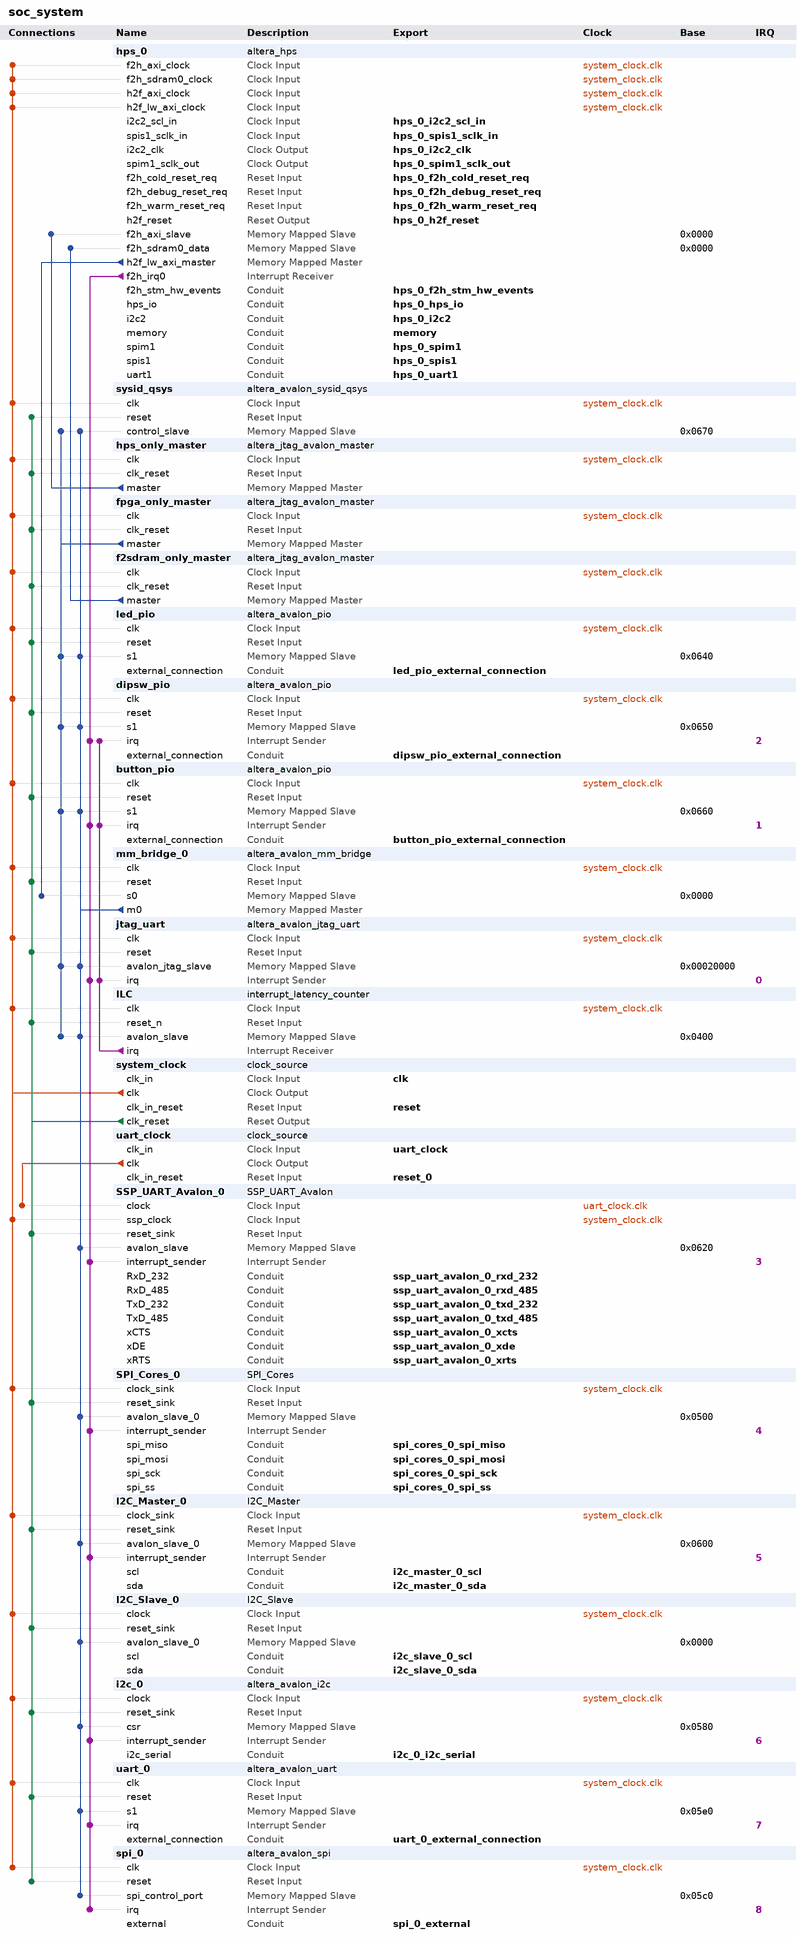
[diagram p0: system contents]
# Platform Designer (Qsys) system soc_system, Cyclone V 5CSXFC6D6F31C6
# Parameters at their usual value, and those the tool derives, are not listed.
package require -exact qsys 18.1
create_system soc_system
set_project_property DEVICE_FAMILY {Cyclone V}
set_project_property DEVICE 5CSXFC6D6F31C6

add_instance hps_0 altera_hps 18.1
set_instance_parameter_value hps_0 EMAC1_Mode RGMII
set_instance_parameter_value hps_0 EMAC1_PinMuxing {HPS I/O Set 0}
set_instance_parameter_value hps_0 F2SCLK_COLDRST_Enable true
set_instance_parameter_value hps_0 F2SCLK_DBGRST_Enable true
set_instance_parameter_value hps_0 F2SCLK_WARMRST_Enable true
set_instance_parameter_value hps_0 F2SDRAM_Type {Avalon-MM Bidirectional}
set_instance_parameter_value hps_0 F2SDRAM_Width 256
set_instance_parameter_value hps_0 F2SINTERRUPT_Enable true
set_instance_parameter_value hps_0 F2S_Width 2
set_instance_parameter_value hps_0 FPGA_PERIPHERAL_OUTPUT_CLOCK_FREQ_EMAC0_GTX_CLK 100
set_instance_parameter_value hps_0 FPGA_PERIPHERAL_OUTPUT_CLOCK_FREQ_EMAC0_MD_CLK 100.0
set_instance_parameter_value hps_0 FPGA_PERIPHERAL_OUTPUT_CLOCK_FREQ_EMAC1_GTX_CLK 100
set_instance_parameter_value hps_0 FPGA_PERIPHERAL_OUTPUT_CLOCK_FREQ_EMAC1_MD_CLK 100.0
set_instance_parameter_value hps_0 HPS_PROTOCOL DDR3
set_instance_parameter_value hps_0 I2C0_Mode I2C
set_instance_parameter_value hps_0 I2C0_PinMuxing {HPS I/O Set 0}
set_instance_parameter_value hps_0 I2C1_Mode I2C
set_instance_parameter_value hps_0 I2C1_PinMuxing {HPS I/O Set 0}
set_instance_parameter_value hps_0 I2C2_Mode Full
set_instance_parameter_value hps_0 I2C2_PinMuxing FPGA
set_instance_parameter_value hps_0 LWH2F_Enable true
set_instance_parameter_value hps_0 MEM_BANKADDR_WIDTH 3
set_instance_parameter_value hps_0 MEM_CLK_FREQ 400.0
set_instance_parameter_value hps_0 MEM_COL_ADDR_WIDTH 10
set_instance_parameter_value hps_0 MEM_DQ_WIDTH 32
set_instance_parameter_value hps_0 MEM_DRV_STR RZQ/6
set_instance_parameter_value hps_0 MEM_ROW_ADDR_WIDTH 15
set_instance_parameter_value hps_0 MEM_RTT_NOM RZQ/6
set_instance_parameter_value hps_0 MEM_RTT_WR {Dynamic ODT off}
set_instance_parameter_value hps_0 MEM_TCL 11
set_instance_parameter_value hps_0 MEM_TFAW_NS 45.0
set_instance_parameter_value hps_0 MEM_TRAS_NS 35.0
set_instance_parameter_value hps_0 MEM_TRCD_NS 13.75
set_instance_parameter_value hps_0 MEM_TRFC_NS 260.0
set_instance_parameter_value hps_0 MEM_TRP_NS 13.75
set_instance_parameter_value hps_0 MEM_VENDOR Micron
set_instance_parameter_value hps_0 MEM_WTCL 7
set_instance_parameter_value hps_0 QSPI_Mode {1 SS}
set_instance_parameter_value hps_0 QSPI_PinMuxing {HPS I/O Set 0}
set_instance_parameter_value hps_0 REF_CLK_FREQ 25.0
set_instance_parameter_value hps_0 S2FCLK_USER2CLK 5
set_instance_parameter_value hps_0 S2F_Width 2
set_instance_parameter_value hps_0 SDIO_Mode {4-bit Data}
set_instance_parameter_value hps_0 SDIO_PinMuxing {HPS I/O Set 0}
set_instance_parameter_value hps_0 SPIM0_Mode {Single Slave Select}
set_instance_parameter_value hps_0 SPIM0_PinMuxing {HPS I/O Set 0}
set_instance_parameter_value hps_0 SPIM1_Mode Full
set_instance_parameter_value hps_0 SPIM1_PinMuxing FPGA
set_instance_parameter_value hps_0 SPIS1_Mode Full
set_instance_parameter_value hps_0 SPIS1_PinMuxing FPGA
set_instance_parameter_value hps_0 STM_Enable true
set_instance_parameter_value hps_0 TIMING_BOARD_AC_SKEW 0.02
set_instance_parameter_value hps_0 TIMING_BOARD_AC_TO_CK_SKEW 0.01
set_instance_parameter_value hps_0 TIMING_BOARD_DQ_TO_DQS_SKEW 0.05
set_instance_parameter_value hps_0 TIMING_BOARD_MAX_CK_DELAY 0.03
set_instance_parameter_value hps_0 TIMING_BOARD_MAX_DQS_DELAY 0.02
set_instance_parameter_value hps_0 TIMING_BOARD_SKEW_BETWEEN_DQS 0.06
set_instance_parameter_value hps_0 TIMING_BOARD_SKEW_CKDQS_DIMM_MAX 0.12
set_instance_parameter_value hps_0 TIMING_BOARD_SKEW_CKDQS_DIMM_MIN 0.06
set_instance_parameter_value hps_0 TIMING_BOARD_SKEW_WITHIN_DQS 0.01
set_instance_parameter_value hps_0 TIMING_TDH 65
set_instance_parameter_value hps_0 TIMING_TDQSCK 255
set_instance_parameter_value hps_0 TIMING_TDQSQ 125
set_instance_parameter_value hps_0 TIMING_TDS 30
set_instance_parameter_value hps_0 TIMING_TIH 140
set_instance_parameter_value hps_0 TIMING_TIS 190
set_instance_parameter_value hps_0 TIMING_TQSH 0.4
set_instance_parameter_value hps_0 UART0_Mode {No Flow Control}
set_instance_parameter_value hps_0 UART0_PinMuxing {HPS I/O Set 0}
set_instance_parameter_value hps_0 UART1_Mode Full
set_instance_parameter_value hps_0 UART1_PinMuxing FPGA
set_instance_parameter_value hps_0 USB1_Mode SDR
set_instance_parameter_value hps_0 USB1_PinMuxing {HPS I/O Set 0}
set_instance_parameter_value hps_0 desired_cfg_clk_mhz 100.0
set_instance_parameter_value hps_0 desired_qspi_clk_mhz 400.0

add_instance sysid_qsys altera_avalon_sysid_qsys 18.1
set_instance_parameter_value sysid_qsys id -1395322110

add_instance hps_only_master altera_jtag_avalon_master 18.1

add_instance fpga_only_master altera_jtag_avalon_master 18.1

add_instance f2sdram_only_master altera_jtag_avalon_master 18.1

add_instance led_pio altera_avalon_pio 18.1
set_instance_parameter_value led_pio direction Output
set_instance_parameter_value led_pio width 10

add_instance dipsw_pio altera_avalon_pio 18.1
set_instance_parameter_value dipsw_pio bitClearingEdgeCapReg true
set_instance_parameter_value dipsw_pio captureEdge true
set_instance_parameter_value dipsw_pio direction Input
set_instance_parameter_value dipsw_pio edgeType ANY
set_instance_parameter_value dipsw_pio generateIRQ true
set_instance_parameter_value dipsw_pio irqType EDGE
set_instance_parameter_value dipsw_pio width 10

add_instance button_pio altera_avalon_pio 18.1
set_instance_parameter_value button_pio bitClearingEdgeCapReg true
set_instance_parameter_value button_pio captureEdge true
set_instance_parameter_value button_pio direction Input
set_instance_parameter_value button_pio edgeType FALLING
set_instance_parameter_value button_pio generateIRQ true
set_instance_parameter_value button_pio irqType EDGE
set_instance_parameter_value button_pio width 4

add_instance mm_bridge_0 altera_avalon_mm_bridge 18.1
set_instance_parameter_value mm_bridge_0 ADDRESS_UNITS SYMBOLS
set_instance_parameter_value mm_bridge_0 ADDRESS_WIDTH 10
set_instance_parameter_value mm_bridge_0 DATA_WIDTH 32
set_instance_parameter_value mm_bridge_0 MAX_PENDING_RESPONSES 4
set_instance_parameter_value mm_bridge_0 USE_AUTO_ADDRESS_WIDTH 1

add_instance jtag_uart altera_avalon_jtag_uart 18.1
set_instance_parameter_value jtag_uart allowMultipleConnections true
set_instance_parameter_value jtag_uart simInteractiveOptions INTERACTIVE_ASCII_OUTPUT

add_instance ILC interrupt_latency_counter 18.1
set_instance_parameter_value ILC CLOCK_RATE 150000000

add_instance system_clock clock_source 18.1
set_instance_parameter_value system_clock clockFrequency 150000000

add_instance uart_clock clock_source 18.1
set_instance_parameter_value uart_clock clockFrequency 48000000

add_instance SSP_UART_Avalon_0 SSP_UART_Avalon 1.0

add_instance SPI_Cores_0 SPI_Cores 1.0
set_instance_parameter_value SPI_Cores_0 Tp 1

add_instance I2C_Master_0 I2C_Master 1.0

add_instance I2C_Slave_0 I2C_Slave 1.0

add_instance i2c_0 altera_avalon_i2c 18.1
set_instance_parameter_value i2c_0 FIFO_DEPTH 256

add_instance uart_0 altera_avalon_uart 18.1
set_instance_parameter_value uart_0 baud 115200
set_instance_parameter_value uart_0 dataBits 8
set_instance_parameter_value uart_0 fixedBaud false
set_instance_parameter_value uart_0 parity NONE
set_instance_parameter_value uart_0 stopBits 1

add_instance spi_0 altera_avalon_spi 18.1
set_instance_parameter_value spi_0 clockPolarity 0
set_instance_parameter_value spi_0 dataWidth 8
set_instance_parameter_value spi_0 masterSPI false
set_instance_parameter_value spi_0 numberOfSlaves 1
set_instance_parameter_value spi_0 targetClockRate 128000

# connections
add_connection system_clock.clk button_pio.clk clock
add_connection system_clock.clk dipsw_pio.clk clock
add_connection system_clock.clk f2sdram_only_master.clk clock
add_connection system_clock.clk fpga_only_master.clk clock
add_connection system_clock.clk hps_0.f2h_axi_clock clock
add_connection system_clock.clk hps_0.f2h_sdram0_clock clock
add_connection system_clock.clk hps_0.h2f_axi_clock clock
add_connection system_clock.clk hps_0.h2f_lw_axi_clock clock
add_connection system_clock.clk hps_only_master.clk clock
add_connection system_clock.clk i2c_0.clock clock
add_connection system_clock.clk I2C_Master_0.clock_sink clock
add_connection system_clock.clk I2C_Slave_0.clock clock
add_connection system_clock.clk ILC.clk clock
add_connection system_clock.clk jtag_uart.clk clock
add_connection system_clock.clk led_pio.clk clock
add_connection system_clock.clk mm_bridge_0.clk clock
add_connection system_clock.clk spi_0.clk clock
add_connection system_clock.clk SPI_Cores_0.clock_sink clock
add_connection system_clock.clk SSP_UART_Avalon_0.ssp_clock clock
add_connection system_clock.clk sysid_qsys.clk clock
add_connection system_clock.clk uart_0.clk clock
add_connection uart_clock.clk SSP_UART_Avalon_0.clock clock
add_connection system_clock.clk_reset button_pio.reset reset
add_connection system_clock.clk_reset dipsw_pio.reset reset
add_connection system_clock.clk_reset f2sdram_only_master.clk_reset reset
add_connection system_clock.clk_reset fpga_only_master.clk_reset reset
add_connection system_clock.clk_reset hps_only_master.clk_reset reset
add_connection system_clock.clk_reset i2c_0.reset_sink reset
add_connection system_clock.clk_reset I2C_Master_0.reset_sink reset
add_connection system_clock.clk_reset I2C_Slave_0.reset_sink reset
add_connection system_clock.clk_reset ILC.reset_n reset
add_connection system_clock.clk_reset jtag_uart.reset reset
add_connection system_clock.clk_reset led_pio.reset reset
add_connection system_clock.clk_reset mm_bridge_0.reset reset
add_connection system_clock.clk_reset spi_0.reset reset
add_connection system_clock.clk_reset SPI_Cores_0.reset_sink reset
add_connection system_clock.clk_reset SSP_UART_Avalon_0.reset_sink reset
add_connection system_clock.clk_reset sysid_qsys.reset reset
add_connection system_clock.clk_reset uart_0.reset reset
add_connection f2sdram_only_master.master hps_0.f2h_sdram0_data avalon
set_connection_parameter_value f2sdram_only_master.master/hps_0.f2h_sdram0_data baseAddress 0x0000
add_connection fpga_only_master.master button_pio.s1 avalon
set_connection_parameter_value fpga_only_master.master/button_pio.s1 baseAddress 0x0660
add_connection fpga_only_master.master dipsw_pio.s1 avalon
set_connection_parameter_value fpga_only_master.master/dipsw_pio.s1 baseAddress 0x0650
add_connection fpga_only_master.master ILC.avalon_slave avalon
set_connection_parameter_value fpga_only_master.master/ILC.avalon_slave baseAddress 0x0400
add_connection fpga_only_master.master jtag_uart.avalon_jtag_slave avalon
set_connection_parameter_value fpga_only_master.master/jtag_uart.avalon_jtag_slave baseAddress 0x00020000
add_connection fpga_only_master.master led_pio.s1 avalon
set_connection_parameter_value fpga_only_master.master/led_pio.s1 baseAddress 0x0640
add_connection fpga_only_master.master sysid_qsys.control_slave avalon
set_connection_parameter_value fpga_only_master.master/sysid_qsys.control_slave baseAddress 0x0670
add_connection hps_0.h2f_lw_axi_master mm_bridge_0.s0 avalon
set_connection_parameter_value hps_0.h2f_lw_axi_master/mm_bridge_0.s0 baseAddress 0x0000
add_connection hps_only_master.master hps_0.f2h_axi_slave avalon
set_connection_parameter_value hps_only_master.master/hps_0.f2h_axi_slave baseAddress 0x0000
add_connection mm_bridge_0.m0 button_pio.s1 avalon
set_connection_parameter_value mm_bridge_0.m0/button_pio.s1 baseAddress 0x0660
add_connection mm_bridge_0.m0 dipsw_pio.s1 avalon
set_connection_parameter_value mm_bridge_0.m0/dipsw_pio.s1 baseAddress 0x0650
add_connection mm_bridge_0.m0 i2c_0.csr avalon
set_connection_parameter_value mm_bridge_0.m0/i2c_0.csr baseAddress 0x0580
add_connection mm_bridge_0.m0 I2C_Master_0.avalon_slave_0 avalon
set_connection_parameter_value mm_bridge_0.m0/I2C_Master_0.avalon_slave_0 baseAddress 0x0600
add_connection mm_bridge_0.m0 I2C_Slave_0.avalon_slave_0 avalon
set_connection_parameter_value mm_bridge_0.m0/I2C_Slave_0.avalon_slave_0 baseAddress 0x0000
add_connection mm_bridge_0.m0 ILC.avalon_slave avalon
set_connection_parameter_value mm_bridge_0.m0/ILC.avalon_slave baseAddress 0x0400
add_connection mm_bridge_0.m0 jtag_uart.avalon_jtag_slave avalon
set_connection_parameter_value mm_bridge_0.m0/jtag_uart.avalon_jtag_slave baseAddress 0x00020000
add_connection mm_bridge_0.m0 led_pio.s1 avalon
set_connection_parameter_value mm_bridge_0.m0/led_pio.s1 baseAddress 0x0640
add_connection mm_bridge_0.m0 spi_0.spi_control_port avalon
set_connection_parameter_value mm_bridge_0.m0/spi_0.spi_control_port baseAddress 0x05c0
add_connection mm_bridge_0.m0 SPI_Cores_0.avalon_slave_0 avalon
set_connection_parameter_value mm_bridge_0.m0/SPI_Cores_0.avalon_slave_0 baseAddress 0x0500
add_connection mm_bridge_0.m0 SSP_UART_Avalon_0.avalon_slave avalon
set_connection_parameter_value mm_bridge_0.m0/SSP_UART_Avalon_0.avalon_slave baseAddress 0x0620
add_connection mm_bridge_0.m0 sysid_qsys.control_slave avalon
set_connection_parameter_value mm_bridge_0.m0/sysid_qsys.control_slave baseAddress 0x0670
add_connection mm_bridge_0.m0 uart_0.s1 avalon
set_connection_parameter_value mm_bridge_0.m0/uart_0.s1 baseAddress 0x05e0
add_connection hps_0.f2h_irq0 button_pio.irq interrupt
set_connection_parameter_value hps_0.f2h_irq0/button_pio.irq irqNumber 1
add_connection hps_0.f2h_irq0 dipsw_pio.irq interrupt
set_connection_parameter_value hps_0.f2h_irq0/dipsw_pio.irq irqNumber 0
add_connection hps_0.f2h_irq0 i2c_0.interrupt_sender interrupt
set_connection_parameter_value hps_0.f2h_irq0/i2c_0.interrupt_sender irqNumber 6
add_connection hps_0.f2h_irq0 I2C_Master_0.interrupt_sender interrupt
set_connection_parameter_value hps_0.f2h_irq0/I2C_Master_0.interrupt_sender irqNumber 5
add_connection hps_0.f2h_irq0 jtag_uart.irq interrupt
set_connection_parameter_value hps_0.f2h_irq0/jtag_uart.irq irqNumber 2
add_connection hps_0.f2h_irq0 spi_0.irq interrupt
set_connection_parameter_value hps_0.f2h_irq0/spi_0.irq irqNumber 8
add_connection hps_0.f2h_irq0 SPI_Cores_0.interrupt_sender interrupt
set_connection_parameter_value hps_0.f2h_irq0/SPI_Cores_0.interrupt_sender irqNumber 4
add_connection hps_0.f2h_irq0 SSP_UART_Avalon_0.interrupt_sender interrupt
set_connection_parameter_value hps_0.f2h_irq0/SSP_UART_Avalon_0.interrupt_sender irqNumber 3
add_connection hps_0.f2h_irq0 uart_0.irq interrupt
set_connection_parameter_value hps_0.f2h_irq0/uart_0.irq irqNumber 7
add_connection ILC.irq button_pio.irq interrupt
set_connection_parameter_value ILC.irq/button_pio.irq irqNumber 1
add_connection ILC.irq dipsw_pio.irq interrupt
set_connection_parameter_value ILC.irq/dipsw_pio.irq irqNumber 2
add_connection ILC.irq jtag_uart.irq interrupt
set_connection_parameter_value ILC.irq/jtag_uart.irq irqNumber 0

# exported interfaces
add_interface button_pio_external_connection conduit end
set_interface_property button_pio_external_connection EXPORT_OF button_pio.external_connection
add_interface clk clock sink
set_interface_property clk EXPORT_OF system_clock.clk_in
add_interface dipsw_pio_external_connection conduit end
set_interface_property dipsw_pio_external_connection EXPORT_OF dipsw_pio.external_connection
add_interface hps_0_f2h_cold_reset_req reset sink
set_interface_property hps_0_f2h_cold_reset_req EXPORT_OF hps_0.f2h_cold_reset_req
add_interface hps_0_f2h_debug_reset_req reset sink
set_interface_property hps_0_f2h_debug_reset_req EXPORT_OF hps_0.f2h_debug_reset_req
add_interface hps_0_f2h_stm_hw_events conduit end
set_interface_property hps_0_f2h_stm_hw_events EXPORT_OF hps_0.f2h_stm_hw_events
add_interface hps_0_f2h_warm_reset_req reset sink
set_interface_property hps_0_f2h_warm_reset_req EXPORT_OF hps_0.f2h_warm_reset_req
add_interface hps_0_h2f_reset reset source
set_interface_property hps_0_h2f_reset EXPORT_OF hps_0.h2f_reset
add_interface hps_0_hps_io conduit end
set_interface_property hps_0_hps_io EXPORT_OF hps_0.hps_io
add_interface hps_0_i2c2 conduit end
set_interface_property hps_0_i2c2 EXPORT_OF hps_0.i2c2
add_interface hps_0_i2c2_clk clock source
set_interface_property hps_0_i2c2_clk EXPORT_OF hps_0.i2c2_clk
add_interface hps_0_i2c2_scl_in clock sink
set_interface_property hps_0_i2c2_scl_in EXPORT_OF hps_0.i2c2_scl_in
add_interface hps_0_spim1 conduit end
set_interface_property hps_0_spim1 EXPORT_OF hps_0.spim1
add_interface hps_0_spim1_sclk_out clock source
set_interface_property hps_0_spim1_sclk_out EXPORT_OF hps_0.spim1_sclk_out
add_interface hps_0_spis1 conduit end
set_interface_property hps_0_spis1 EXPORT_OF hps_0.spis1
add_interface hps_0_spis1_sclk_in clock sink
set_interface_property hps_0_spis1_sclk_in EXPORT_OF hps_0.spis1_sclk_in
add_interface hps_0_uart1 conduit end
set_interface_property hps_0_uart1 EXPORT_OF hps_0.uart1
add_interface i2c_0_i2c_serial conduit end
set_interface_property i2c_0_i2c_serial EXPORT_OF i2c_0.i2c_serial
add_interface i2c_master_0_scl conduit end
set_interface_property i2c_master_0_scl EXPORT_OF I2C_Master_0.scl
add_interface i2c_master_0_sda conduit end
set_interface_property i2c_master_0_sda EXPORT_OF I2C_Master_0.sda
add_interface i2c_slave_0_scl conduit end
set_interface_property i2c_slave_0_scl EXPORT_OF I2C_Slave_0.scl
add_interface i2c_slave_0_sda conduit end
set_interface_property i2c_slave_0_sda EXPORT_OF I2C_Slave_0.sda
add_interface led_pio_external_connection conduit end
set_interface_property led_pio_external_connection EXPORT_OF led_pio.external_connection
add_interface memory conduit end
set_interface_property memory EXPORT_OF hps_0.memory
add_interface reset reset sink
set_interface_property reset EXPORT_OF system_clock.clk_in_reset
add_interface reset_0 reset sink
set_interface_property reset_0 EXPORT_OF uart_clock.clk_in_reset
add_interface spi_0_external conduit end
set_interface_property spi_0_external EXPORT_OF spi_0.external
add_interface spi_cores_0_spi_miso conduit end
set_interface_property spi_cores_0_spi_miso EXPORT_OF SPI_Cores_0.spi_miso
add_interface spi_cores_0_spi_mosi conduit end
set_interface_property spi_cores_0_spi_mosi EXPORT_OF SPI_Cores_0.spi_mosi
add_interface spi_cores_0_spi_sck conduit end
set_interface_property spi_cores_0_spi_sck EXPORT_OF SPI_Cores_0.spi_sck
add_interface spi_cores_0_spi_ss conduit end
set_interface_property spi_cores_0_spi_ss EXPORT_OF SPI_Cores_0.spi_ss
add_interface ssp_uart_avalon_0_rxd_232 conduit end
set_interface_property ssp_uart_avalon_0_rxd_232 EXPORT_OF SSP_UART_Avalon_0.RxD_232
add_interface ssp_uart_avalon_0_rxd_485 conduit end
set_interface_property ssp_uart_avalon_0_rxd_485 EXPORT_OF SSP_UART_Avalon_0.RxD_485
add_interface ssp_uart_avalon_0_txd_232 conduit end
set_interface_property ssp_uart_avalon_0_txd_232 EXPORT_OF SSP_UART_Avalon_0.TxD_232
add_interface ssp_uart_avalon_0_txd_485 conduit end
set_interface_property ssp_uart_avalon_0_txd_485 EXPORT_OF SSP_UART_Avalon_0.TxD_485
add_interface ssp_uart_avalon_0_xcts conduit end
set_interface_property ssp_uart_avalon_0_xcts EXPORT_OF SSP_UART_Avalon_0.xCTS
add_interface ssp_uart_avalon_0_xde conduit end
set_interface_property ssp_uart_avalon_0_xde EXPORT_OF SSP_UART_Avalon_0.xDE
add_interface ssp_uart_avalon_0_xrts conduit end
set_interface_property ssp_uart_avalon_0_xrts EXPORT_OF SSP_UART_Avalon_0.xRTS
add_interface uart_0_external_connection conduit end
set_interface_property uart_0_external_connection EXPORT_OF uart_0.external_connection
add_interface uart_clock clock sink
set_interface_property uart_clock EXPORT_OF uart_clock.clk_in

set_interconnect_requirement {$system} qsys_mm.clockCrossingAdapter HANDSHAKE
set_interconnect_requirement {$system} qsys_mm.maxAdditionalLatency 1

save_system soc_system.qsys
